# EAGLE design Macropad (EAGLE 9.6.2)
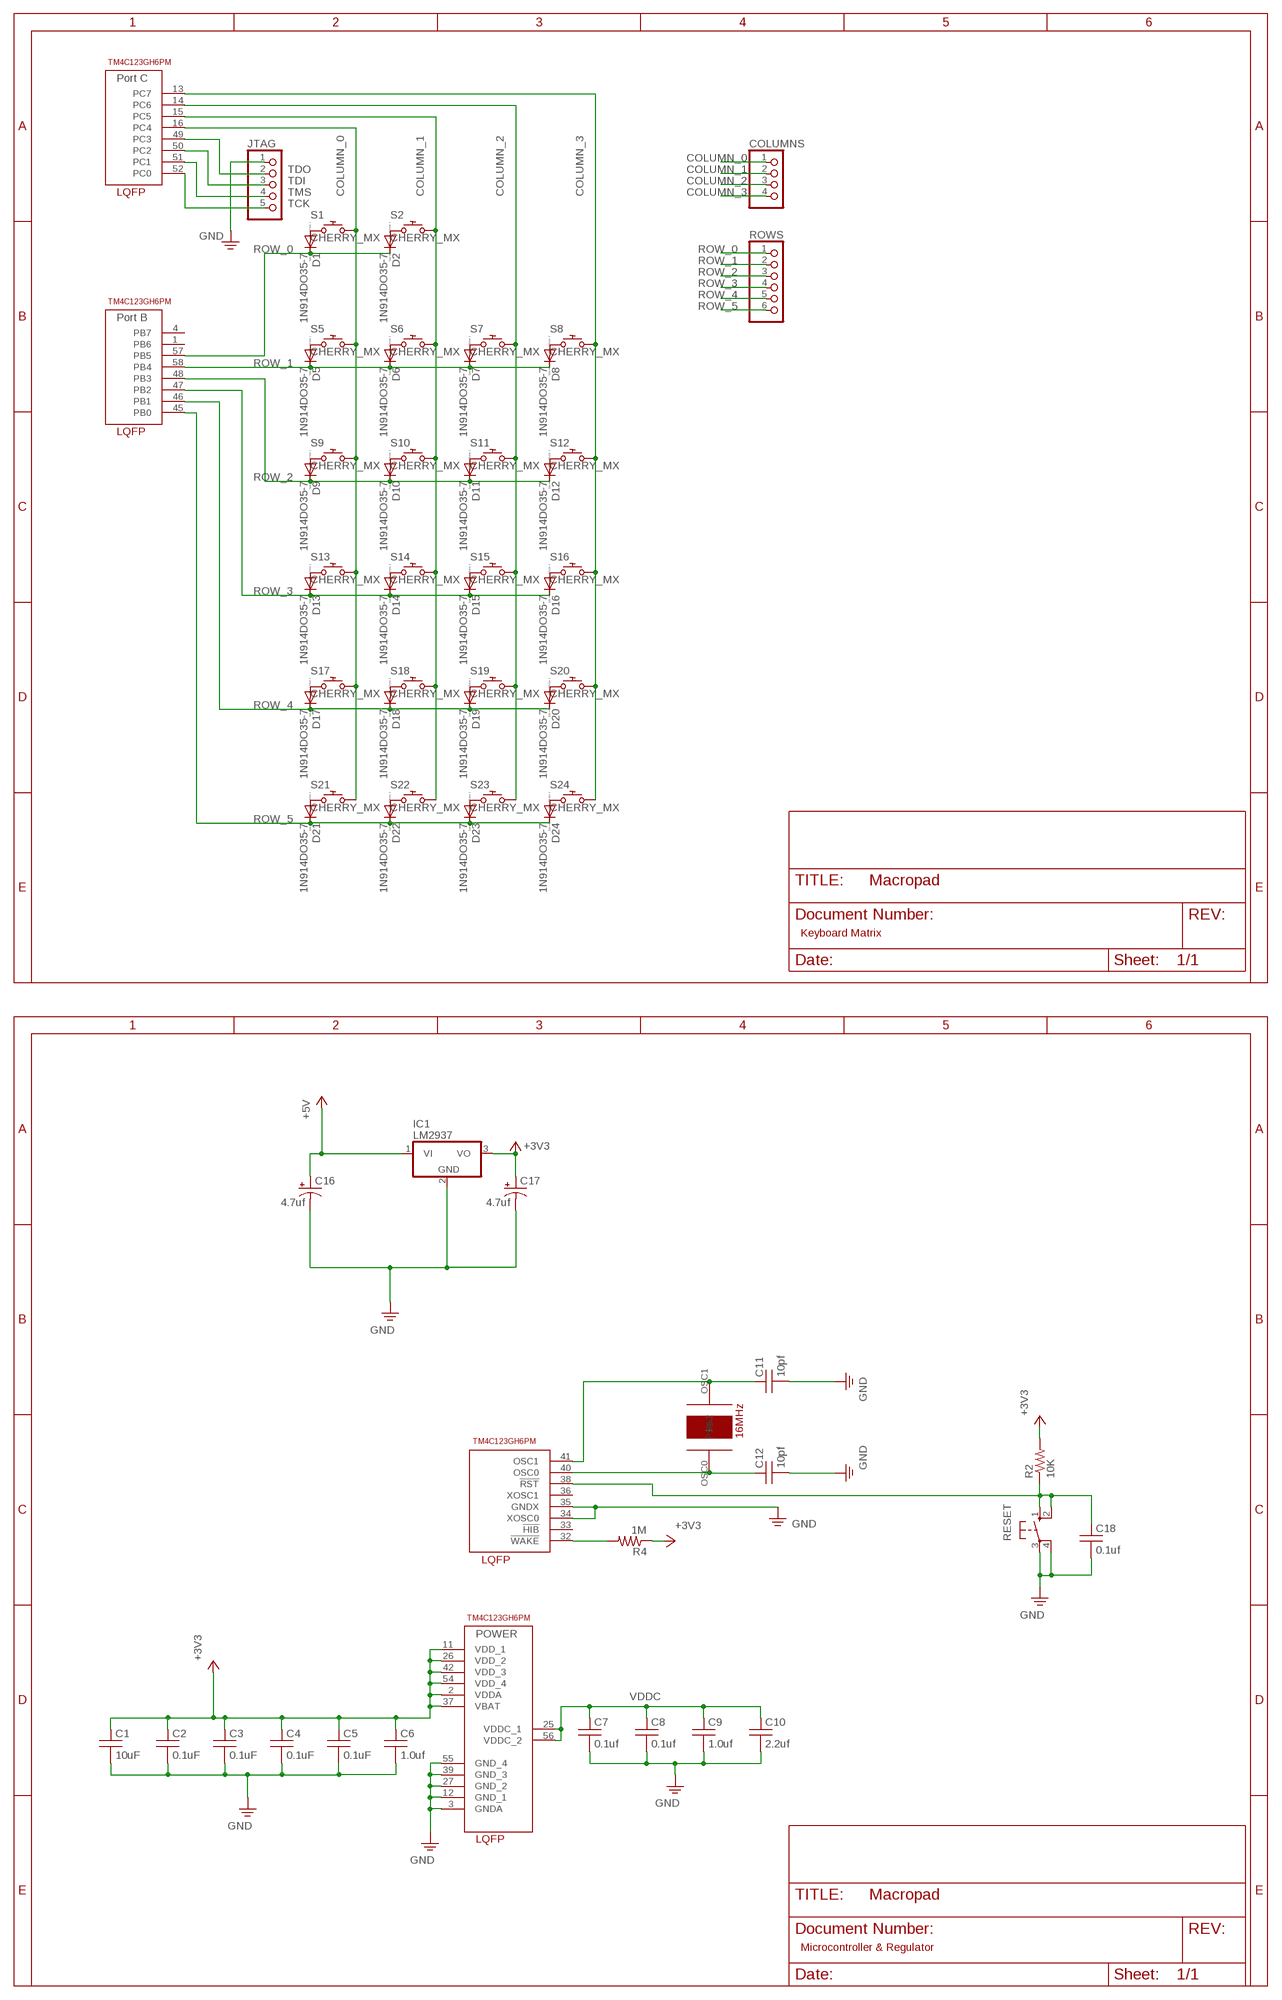
[diagram p0: schematic, sheet 1, part 1 of 2]
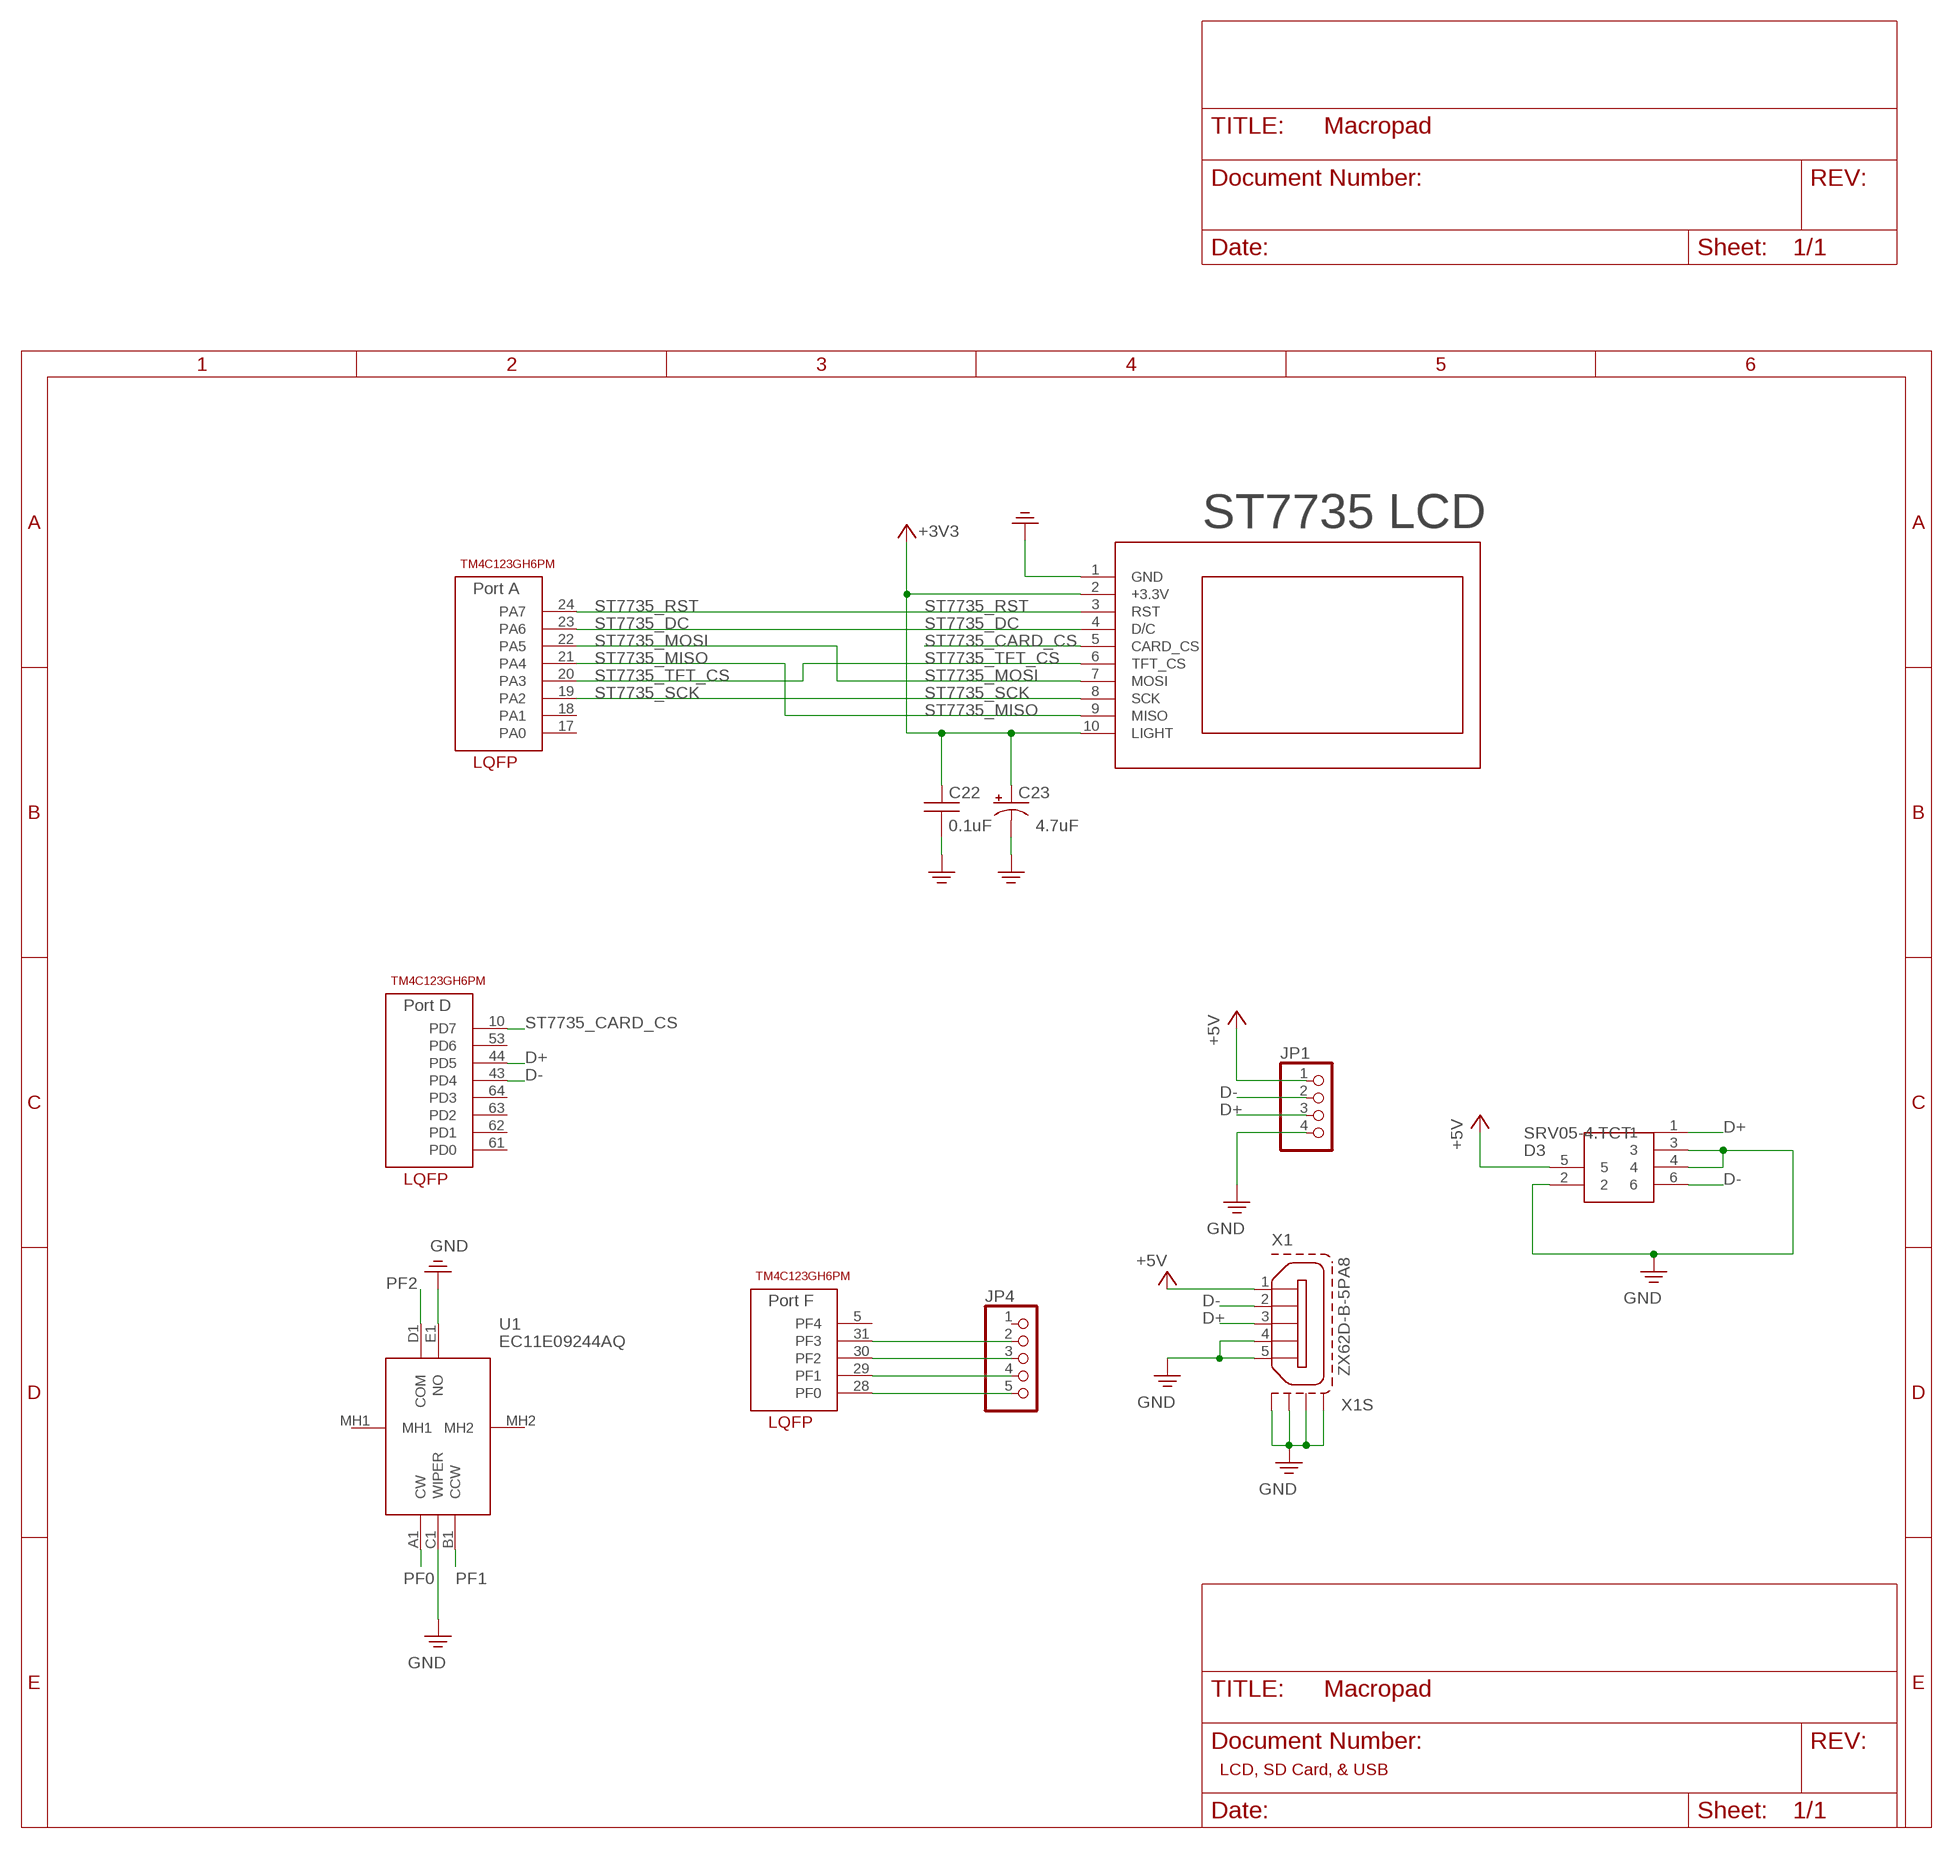
[diagram p1: schematic, sheet 1, part 2 of 2]

## Parts
C1  10uF  CAPACITOR025-024X044  [CAP100MIL]
C2  0.1uF  CAPACITOR025-024X044  [CAP100MIL]
C3  0.1uF  CAPACITOR025-024X044  [CAP100MIL]
C4  0.1uF  CAPACITOR025-024X044  [CAP100MIL]
C5  0.1uF  CAPACITOR025-024X044  [CAP100MIL]
C6  1.0uf  CAPACITOR025-024X044  [CAP100MIL]
C7  0.1uf  CAPACITOR025-024X044  [CAP100MIL]
C8  0.1uf  CAPACITOR025-024X044  [CAP100MIL]
C9  1.0uf  CAPACITOR025-024X044  [CAP100MIL]
C10  2.2uf  CAPACITOR025-024X044  [CAP100MIL]
C11  10pf  CAPACITOR025-024X044  [CAP100MIL]
C12  10pf  CAPACITOR025-024X044  [CAP100MIL]
C16  4.7uf  CAPACITOR_POLARIZEDE5-6  [CAP200MILPOLARIZED]
C17  4.7uf  CAPACITOR_POLARIZEDE5-6  [CAP200MILPOLARIZED]
C18  0.1uf  CAPACITOR025-024X044  [CAP100MIL]
C22  0.1uF  CAPACITOR050-024X044  [CAP200MIL]
C23  4.7uF  CAPACITOR_POLARIZEDE5-6  [CAP200MILPOLARIZED]
COLUMNS  PINHD-1X4  [1X04]
D1  1N914DO35-7  [DO35-7]
D2  1N914DO35-7  [DO35-7]
D3  SRV05-4.TCT  [SOT95P280X145-6N]
D5  1N914DO35-7  [DO35-7]
D6  1N914DO35-7  [DO35-7]
D7  1N914DO35-7  [DO35-7]
D8  1N914DO35-7  [DO35-7]
D9  1N914DO35-7  [DO35-7]
D10  1N914DO35-7  [DO35-7]
D11  1N914DO35-7  [DO35-7]
D12  1N914DO35-7  [DO35-7]
D13  1N914DO35-7  [DO35-7]
D14  1N914DO35-7  [DO35-7]
D15  1N914DO35-7  [DO35-7]
D16  1N914DO35-7  [DO35-7]
D17  1N914DO35-7  [DO35-7]
D18  1N914DO35-7  [DO35-7]
D19  1N914DO35-7  [DO35-7]
D20  1N914DO35-7  [DO35-7]
D21  1N914DO35-7  [DO35-7]
D22  1N914DO35-7  [DO35-7]
D23  1N914DO35-7  [DO35-7]
D24  1N914DO35-7  [DO35-7]
IC1  LM2937  [TO220]
JP1  PINHD-1X4  [1X04]
JP4  PINHD-1X5  [1X05]
JTAG  PINHD-1X5  [1X05]
R2  10K  RESISTOR0204/5  [RES200MIL]
R4  1M  RESISTOR0204/5  [RES200MIL]
RESET  B3F-1052  [B3F-10XX]
ROWS  PINHD-1X6  [1X06]
S1  CHERRY_MX  [CHERRY_MX]
S2  CHERRY_MX  [CHERRY_MX]
S5  CHERRY_MX  [CHERRY_MX]
S6  CHERRY_MX  [CHERRY_MX]
S7  CHERRY_MX  [CHERRY_MX]
S8  CHERRY_MX  [CHERRY_MX]
S9  CHERRY_MX  [CHERRY_MX]
S10  CHERRY_MX  [CHERRY_MX]
S11  CHERRY_MX  [CHERRY_MX]
S12  CHERRY_MX  [CHERRY_MX]
S13  CHERRY_MX  [CHERRY_MX]
S14  CHERRY_MX  [CHERRY_MX]
S15  CHERRY_MX  [CHERRY_MX]
S16  CHERRY_MX  [CHERRY_MX]
S17  CHERRY_MX  [CHERRY_MX]
S18  CHERRY_MX  [CHERRY_MX]
S19  CHERRY_MX  [CHERRY_MX]
S20  CHERRY_MX  [CHERRY_MX]
S21  CHERRY_MX  [CHERRY_MX]
S22  CHERRY_MX  [CHERRY_MX]
S23  CHERRY_MX  [CHERRY_MX]
S24  CHERRY_MX  [CHERRY_MX]
U1  EC11E09244AQ  [EC11E09244AQ]
U$1  TM4C123GH6PM  [QFP50P1200X1200X160-64N]
U$2  16MHZ_CRYSTAL  [16MHZ_CRYSTAL]
U$6  ST7735  [ST7735]
X1  ZX62D-B-5PA8  [ZX62D-B-5PA8]

## Nets
+3V3: C1.1 C2.1 C3.1 C4.1 C5.1 C6.1 C17.+ C22.1 C23.+ IC1.3(VO) R2.2 R4.1 U$1.2(VDDA) U$1.11(VDD_1) U$1.26(VDD_2) U$1.37(VBAT) U$1.42(VDD_3) U$1.54(VDD_4) U$6.2(+3.3V) U$6.10(LIGHT)
+5V: C16.+ D3.5 IC1.1(VI) JP1.1 X1.1
COLUMN_0: COLUMNS.1 S1.S2 S5.S2 S9.S2 S13.S2 S17.S2 S21.S2 U$1.16(PC4)
COLUMN_1: COLUMNS.2 S2.S2 S6.S2 S10.S2 S14.S2 S18.S2 S22.S2 U$1.15(PC5)
COLUMN_2: COLUMNS.3 S7.S2 S11.S2 S15.S2 S19.S2 S23.S2 U$1.14(PC6)
COLUMN_3: COLUMNS.4 S8.S2 S12.S2 S16.S2 S20.S2 S24.S2 U$1.13(PC7)
D+: D3.1 JP1.3 U$1.44(PD5) X1.3
D-: D3.6 JP1.2 U$1.43(PD4) X1.2
GND: C1.2 C2.2 C3.2 C4.2 C5.2 C6.2 C7.2 C8.2 C9.2 C10.2 C11.2 C12.2 C16.- C17.- C18.2 C22.2 C23.- D3.2 D3.3 D3.4 IC1.2(GND) JP1.4 JTAG.1 RESET.3(P) RESET.4(P1) U1.C1(WIPER) U1.E1(NO) U$1.3(GNDA) U$1.12(GND_1) U$1.27(GND_2) U$1.34(XOSC0) U$1.35(GNDX) U$1.39(GND_3) U$1.55(GND_4) U$6.1(GND) X1.4 X1.5 X1.S1 X1.S2 X1.S3 X1.S4
N$3: D1.A S1.S1
N$4: D2.A S2.S1
N$11: D5.A S5.S1
N$12: D6.A S6.S1
N$13: D7.A S7.S1
N$14: D8.A S8.S1
N$15: D9.A S9.S1
N$16: D10.A S10.S1
N$17: D11.A S11.S1
N$18: D12.A S12.S1
N$19: D13.A S13.S1
N$20: D14.A S14.S1
N$21: D15.A S15.S1
N$22: D16.A S16.S1
N$23: D17.A S17.S1
N$24: D18.A S18.S1
N$25: D19.A S19.S1
N$26: D20.A S20.S1
N$27: D21.A S21.S1
N$28: D22.A S22.S1
N$29: D23.A S23.S1
N$30: D24.A S24.S1
OSC0: C12.1 U$1.40(OSC0) U$2.OSC0
OSC1: C11.1 U$1.41(OSC1) U$2.OSC1
PF0: JP4.5 U1.A1(CW) U$1.28(PF0)
PF1: JP4.4 U1.B1(CCW) U$1.29(PF1)
PF2: JP4.3 U1.D1(COM) U$1.30(PF2)
PF3: JP4.2 U$1.31(PF3)
RESET: C18.1 R2.1 RESET.1(S) RESET.2(S1) U$1.38(!RST)
ROW_0: D1.C D2.C ROWS.1 U$1.57(PB5)
ROW_1: D5.C D6.C D7.C D8.C ROWS.2 U$1.58(PB4)
ROW_2: D9.C D10.C D11.C D12.C ROWS.3 U$1.48(PB3)
ROW_3: D13.C D14.C D15.C D16.C ROWS.4 U$1.47(PB2)
ROW_4: D17.C D18.C D19.C D20.C ROWS.5 U$1.46(PB1)
ROW_5: D21.C D22.C D23.C D24.C ROWS.6 U$1.45(PB0)
ST7735_CARD_CS: U$1.10(PD7) U$6.5(CARD_CS)
ST7735_DC: U$1.23(PA6) U$6.4(D/C)
ST7735_MISO: U$1.21(PA4) U$6.9(MISO)
ST7735_MOSI: U$1.22(PA5) U$6.7(MOSI)
ST7735_RST: U$1.24(PA7) U$6.3(RST)
ST7735_SCK: U$1.19(PA2) U$6.8(SCK)
ST7735_TFT_CS: U$1.20(PA3) U$6.6(TFT_CS)
TCK: JTAG.5 U$1.52(PC0)
TDI: JTAG.3 U$1.50(PC2)
TDO: JTAG.2 U$1.49(PC3)
TMS: JTAG.4 U$1.51(PC1)
VDDC: C7.1 C8.1 C9.1 C10.1 U$1.25(VDDC_1) U$1.56(VDDC_2)
WAKE: R4.2 U$1.32(!WAKE)
Unconnected: JP4.1 U1.MH1 U1.MH2 U$1.1(PB6) U$1.4(PB7) U$1.5(PF4) U$1.6(PE3) U$1.7(PE2) U$1.8(PE1) U$1.9(PE0) U$1.17(PA0) U$1.18(PA1) U$1.33(!HIB) U$1.36(XOSC1) U$1.53(PD6) U$1.59(PE4) U$1.60(PE5) U$1.61(PD0) U$1.62(PD1) U$1.63(PD2) U$1.64(PD3)

## Notes on the sheet
- Keyboard Matrix
- ST7735 LCD
- Microcontroller & Regulator | LCD, SD Card, & USB

## Library data of the parts
C1-C12 C18 C22 = EE445L:CAPACITOR: CAPACITOR, American symbol
C16 C17 C23 = EE445L:CAPACITOR_POLARIZED: POLARIZED CAPACITOR, American symbol
COLUMNS JP1 = EE445L:PINHD-1X4: PIN HEADER
D1 D2 D5-D24 = EE445L:1N914: DIODE high speed (Philips) 1N914
D3 = SRV05-4.TCT:SRV05-4.TCT: Semtech SRV05-4.TCT, Uni-Directional TVS Diode Array, 300W, 6-Pin SOT-23 Source: Datasheet <https://componentsearchengine.com/Datasheets/1/SRV05-4.TCT.pdf> Check prices <https://pricing.snapeda.com/parts/SRV05-4.TCT/Semtech/view-part?ref=eda>; AVAILABILITY: In Stock; DESCRIPTION: 17.5V Clamp 12A (8/20µs) Ipp Tvs Diode Surface Mount SOT-23-6; MF: Semtech; MP: SRV05-4.TCT; PACKAGE: SOT-23 Semtech; PRICE: None; PURCHASE-URL: https://pricing.snapeda.com/search/part/SRV05-4.TCT/?ref=eda
IC1 = EE445L:LM2937: LM2937-2.5, LM2937-3.3 400mA and 500mA Voltage Regulators Source: http://cache.national.com/ds/LM/LM2937-2.5.pdf
JP4 JTAG = EE445L:PINHD-1X5: PIN HEADER
R2 R4 = EE445L:RESISTOR: RESISTOR, American symbol
RESET = EE445L:B3F-1052: OMRON SWITCH 1.1mm holes; MPN: B3F-1000; OC_FARNELL: 176432; OC_NEWARK: 36M3542
ROWS = EE445L:PINHD-1X6: PIN HEADER
S1 S2 S5-S24 = cherry:CHERRY_MX: Cherry keymodule MX; FARNELL: 2292961; MOUSER: 540-MX1A-11NW
U1 = SamacSys_Parts:EC11E09244AQ: Encoders 11mm 9 res 18 detent w/ switch lo profile Source: Datasheet <https://componentsearchengine.com/Datasheets/2/EC11E09244AQ.pdf>; DESCRIPTION: Encoders 11mm 9 res 18 detent w/ switch lo profile; HEIGHT: 24.5mm; MANUFACTURER_NAME: Alps Alpine; MANUFACTURER_PART_NUMBER: EC11E09244AQ; MOUSER_PART_NUMBER: 688-EC11E09244AQ; MOUSER_PRICE-STOCK: https://www.mouser.co.uk/ProductDetail/Alps-Alpine/EC11E09244AQ?qs=fMKjfF2mFohVUA4%2Ftyw7NQ%3D%3D
U$1 = EE445L:TM4C123GH6PM
U$2 = EE445L:16MHZ_CRYSTAL
U$6 = EE445L:ST7735
X1 = zx62d-b-5pa8-oshpark_10:ZX62D-B-5PA8: Micro USB Type B Connector - Standard, Shell Through Hole Source: http://www.hirose.co.jp/cataloge_hp/ed_ZX_20140804.pdf; MF: Hirose; MPN: ZX62D-B-5PA8; OC_FARNELL: 2300438; OC_NEWARK: 69W0712

## Board
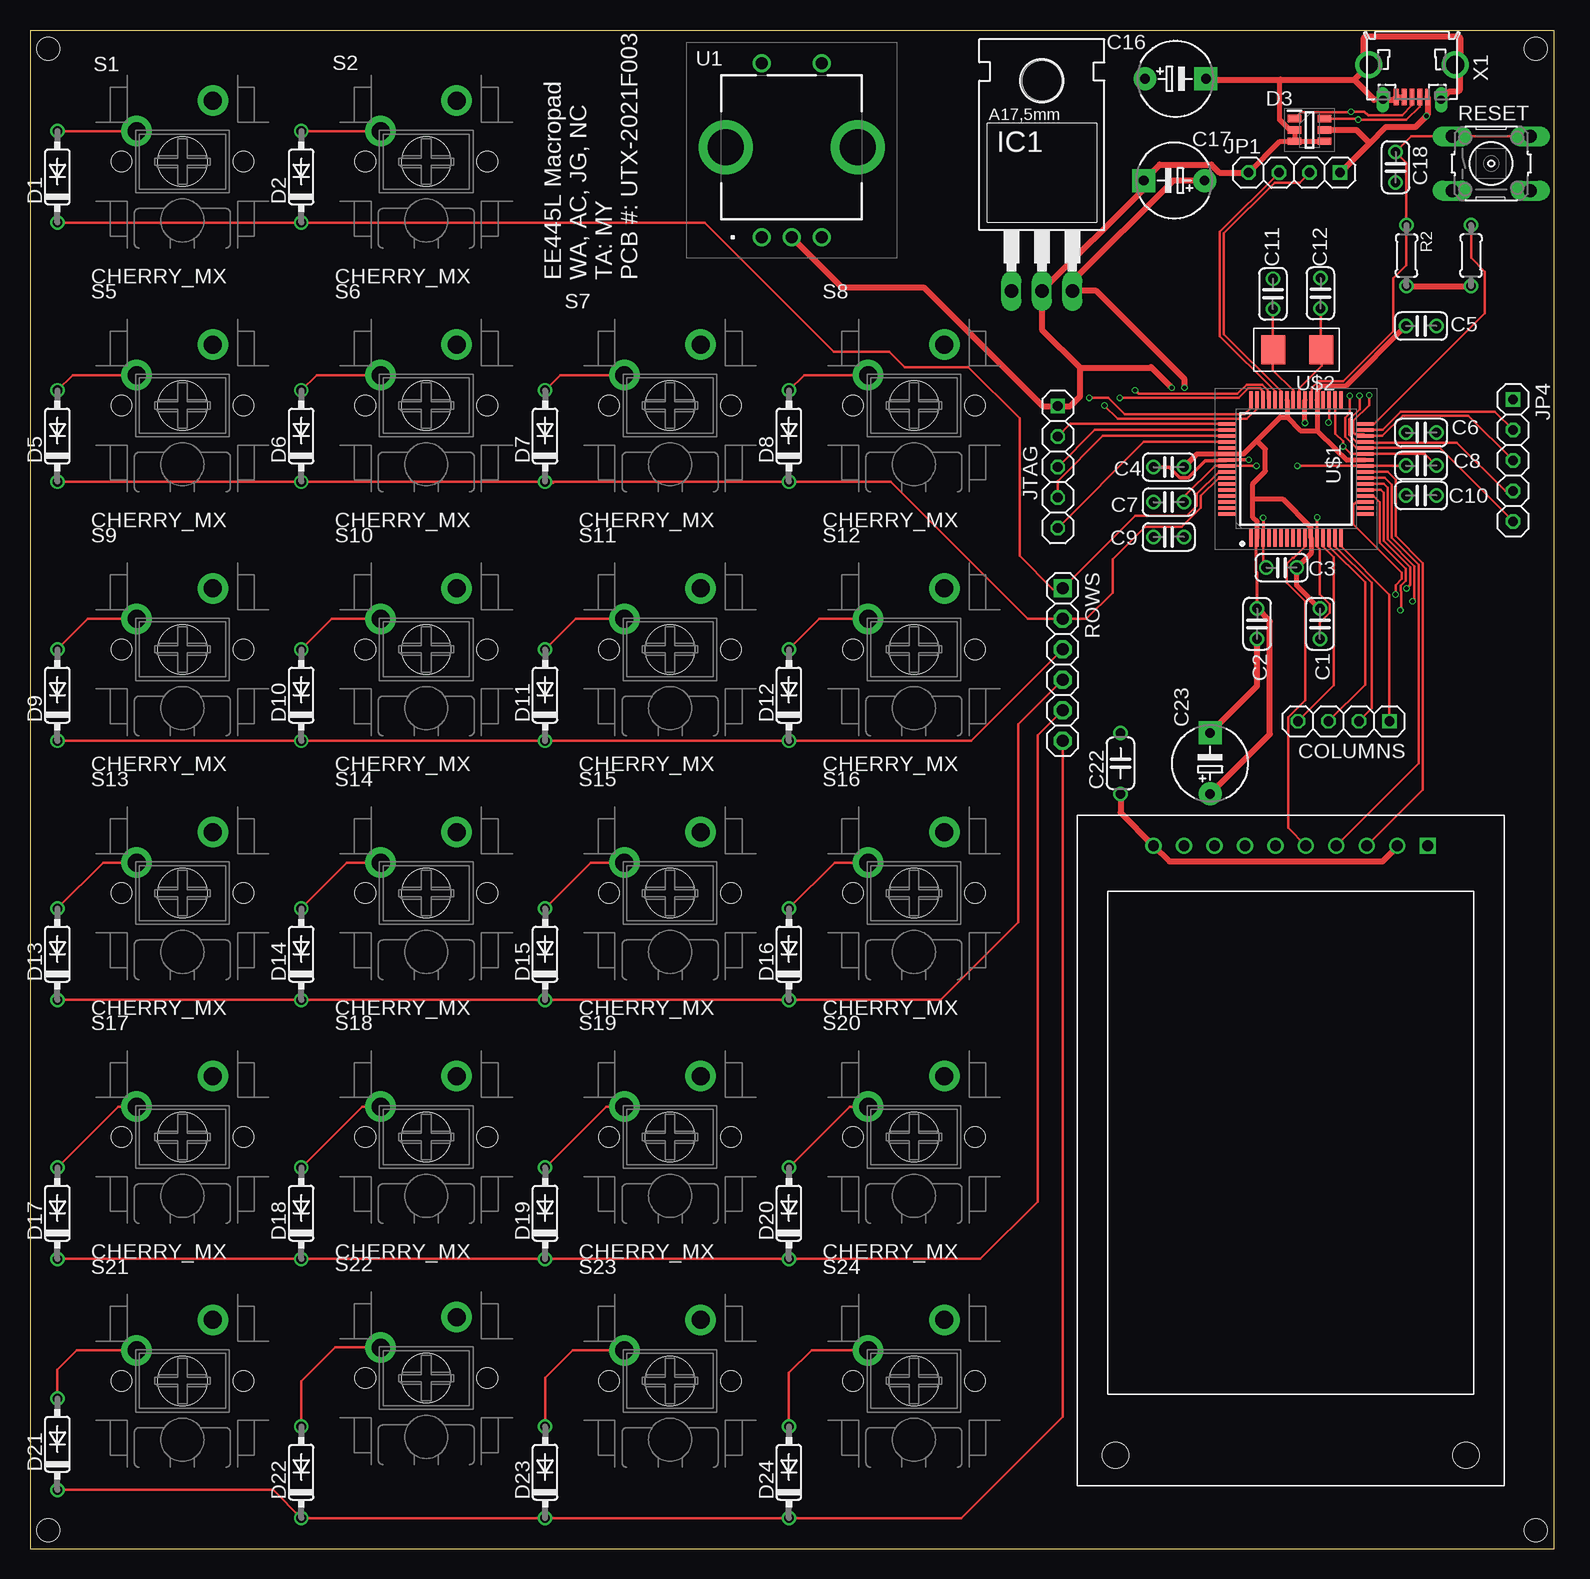
[diagram p2: board, top side]
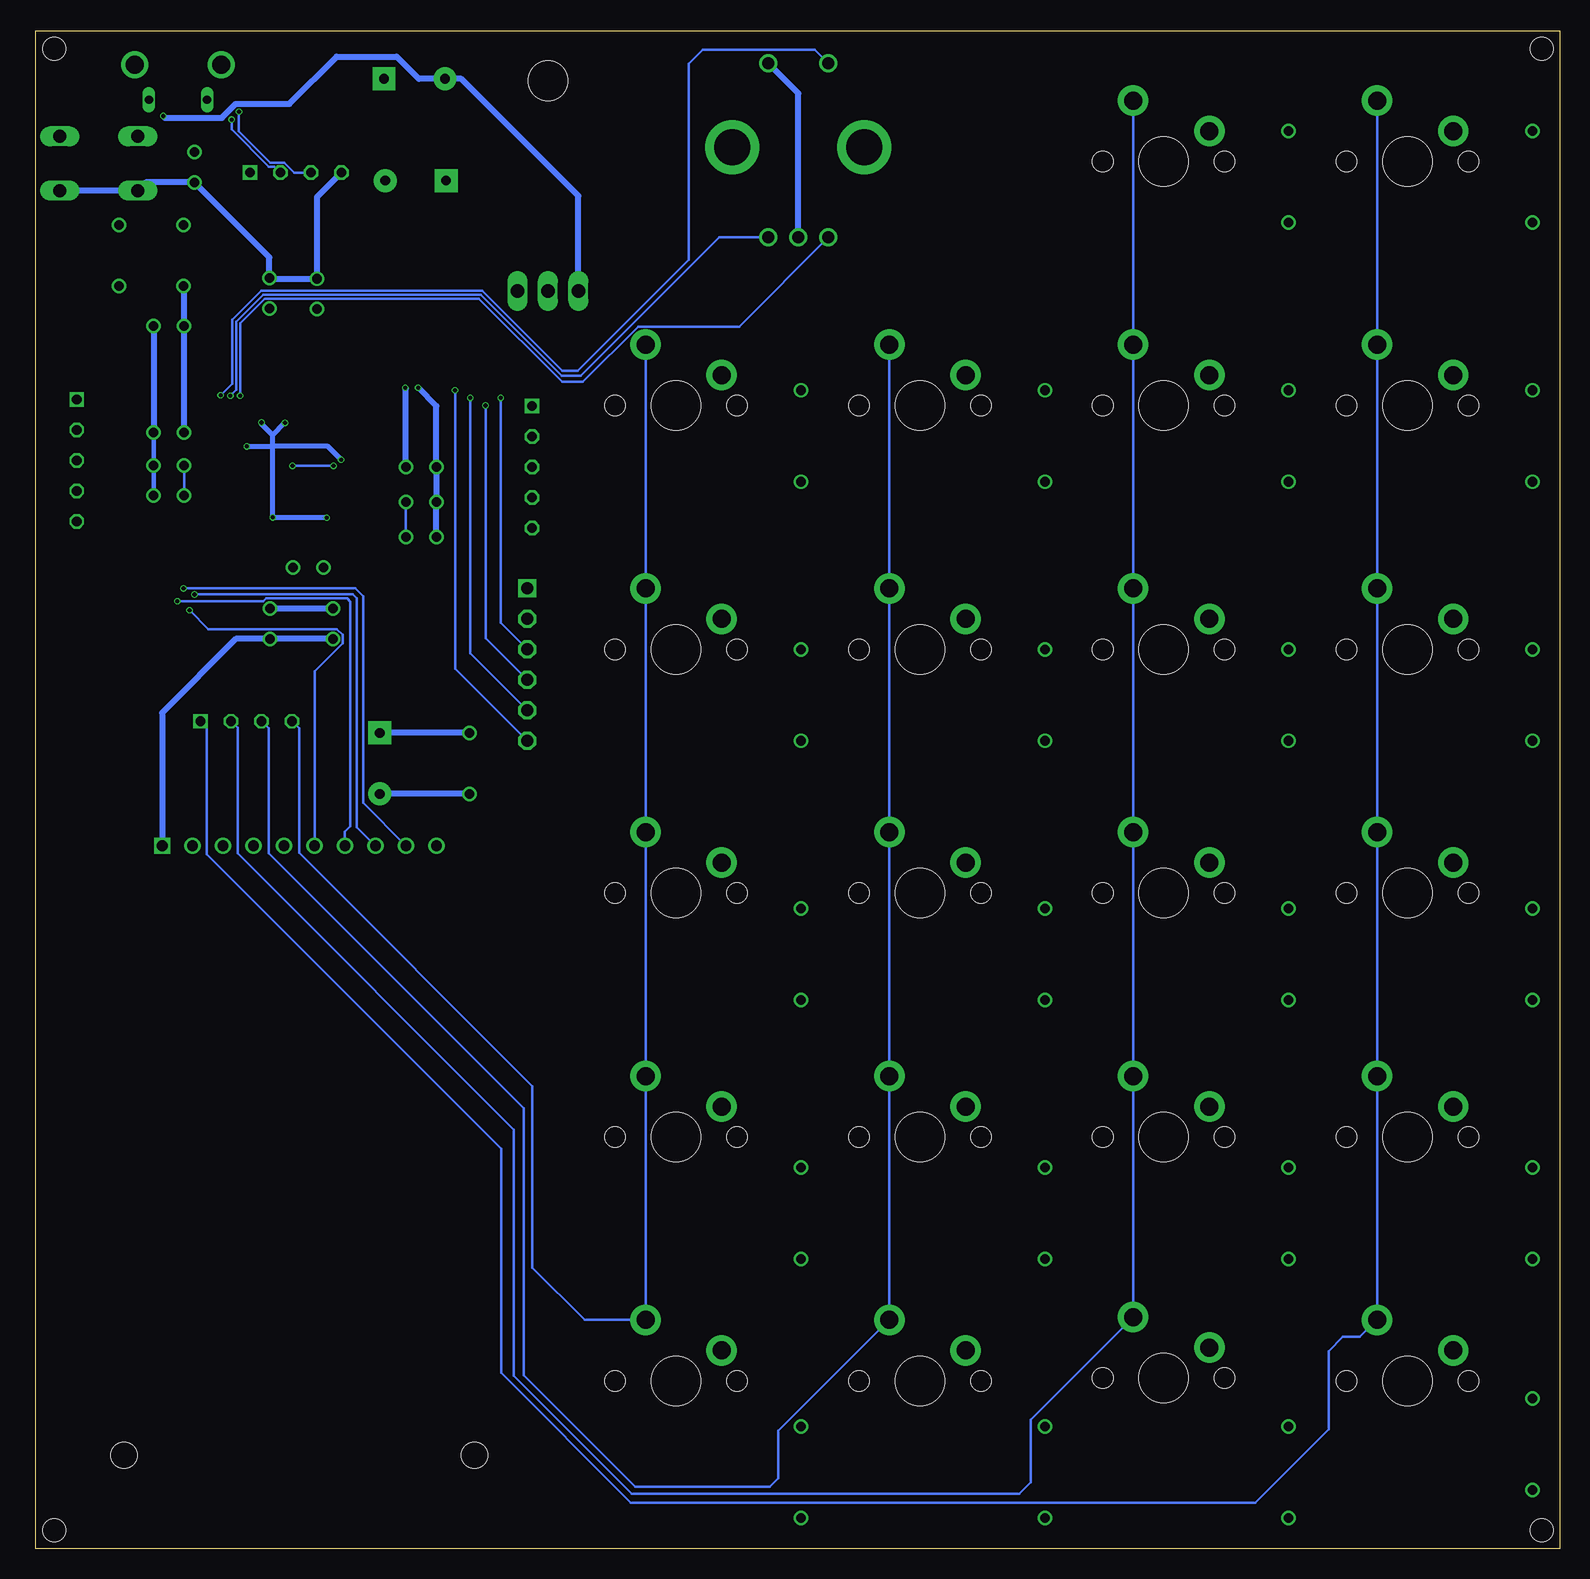
[diagram p3: board, bottom side, seen from below]

Size 127 x 126.49 mm. Coordinates in mm from the lower left corner, seen from the top.
Outline: 0,0 127,0 127,126.49 0,126.49 0,0
Copper layers (1*16): Top 0.035559375mm / dielectric 1.6mm / Bottom 0.035559375mm
Design rules "jlcpcb2layer": minimum track width 5mil, minimum drill 12mil, track to track 5mil, track to pad 5mil, pad to pad 5mil, via to via 5mil, smd to smd 5mil, copper to edge 8mil, drill to drill 6mil, minimum pad ring 5mil, minimum via ring 3mil, stop-mask expansion 2.5mil, vias tented up to drill 0mil, thermal gap 10mil
Holes 1.91 mm at 125.48,124.97 125.48,1.52 1.52,1.52 1.52,124.97

### Footprints (pad centres in the part's own frame; a part is rotated, then mirrored left to right if it is on the bottom)
CAP100MIL = drill 0.8: 1 -1.27,0; 2 1.27,0
CAP200MILPOLARIZED = drill 0.8 pad 1.905: + -2.54,0 | drill 0.8 pad 1.905 square: - 2.54,0
CAP200MIL = drill 0.8: 1 -2.54,0; 2 2.54,0
1X04 = drill 0.8 square: 1 -3.81,0 | drill 0.8 octagon: 2 -1.27,0; 3 1.27,0; 4 3.81,0
DO35-7 = drill 0.8: A 3.81,0; C -3.81,0
SOT95P280X145-6N = smd 1.15 x 0.6: 1 -1.25,0.95; 2 -1.25,0; 3 -1.25,-0.95; 4 1.25,-0.95; 5 1.25,0; 6 1.25,0.95
TO220 = drill 1.1 long: 1 -2.54,-6.35; 2 0,-6.35; 3 2.54,-6.35 | hole 3.302: 0,11.176
1X05 = drill 0.8 square: 1 -5.08,0 | drill 0.8 octagon: 2 -2.54,0; 3 0,0; 4 2.54,0; 5 5.08,0
RES200MIL = drill 0.8: 1 -2.54,0; 2 2.54,0
B3F-10XX = drill 1.1 long: 1 -3.251,2.261; 2 3.251,2.261; 3 -3.251,-2.261; 4 3.251,-2.261
1X06 = drill 1 square: 1 -6.35,0 | drill 1 octagon: 2 -3.81,0; 3 -1.27,0; 4 1.27,0; 5 3.81,0; 6 6.35,0
CHERRY_MX = drill 1.5 pad 2.54: S1 -3.81,2.54; S2 2.54,5.08 | hole 1.7: -5.08,0; 5.08,0 | hole 4.1: 0,0
EC11E09244AQ = drill 1 pad 1.5: A1 0,0; B1 5,0; C1 2.5,0; D1 0,14.5; E1 5,14.5 | drill 3 pad 4.5: MH1 -3,7.5; MH2 8,7.5
QFP50P1200X1200X160-64N = smd 1.475 x 0.3: 1 -5.738,3.75; 2 -5.738,3.25; 3 -5.738,2.75; 4 -5.738,2.25; 5 -5.738,1.75; 6 -5.738,1.25; 7 -5.738,0.75; 8 -5.738,0.25; 9 -5.738,-0.25; 10 -5.738,-0.75; 11 -5.738,-1.25; 12 -5.738,-1.75; 13 -5.738,-2.25; 14 -5.738,-2.75; 15 -5.738,-3.25; 16 -5.738,-3.75; 33 5.738,-3.75; 34 5.738,-3.25; 35 5.738,-2.75; 36 5.738,-2.25; 37 5.738,-1.75; 38 5.738,-1.25; 39 5.738,-0.75; 40 5.738,-0.25; 41 5.738,0.25; 42 5.738,0.75; 43 5.738,1.25; 44 5.738,1.75; 45 5.738,2.25; 46 5.738,2.75; 47 5.738,3.25; 48 5.738,3.75 | smd 0.3 x 1.475: 17 -3.75,-5.738; 18 -3.25,-5.738; 19 -2.75,-5.738; 20 -2.25,-5.738; 21 -1.75,-5.738; 22 -1.25,-5.738; 23 -0.75,-5.738; 24 -0.25,-5.738; 25 0.25,-5.738; 26 0.75,-5.738; 27 1.25,-5.738; 28 1.75,-5.738; 29 2.25,-5.738; 30 2.75,-5.738; 31 3.25,-5.738; 32 3.75,-5.738; 49 3.75,5.738; 50 3.25,5.738; 51 2.75,5.738; 52 2.25,5.738; 53 1.75,5.738; 54 1.25,5.738; 55 0.75,5.738; 56 0.25,5.738; 57 -0.25,5.738; 58 -0.75,5.738; 59 -1.25,5.738; 60 -1.75,5.738; 61 -2.25,5.738; 62 -2.75,5.738; 63 -3.25,5.738; 64 -3.75,5.738
16MHZ_CRYSTAL = smd 2 x 2.4: OSC0 1,1.27; OSC1 5,1.27
ST7735 = drill 0.9 square: 1 0,0 | drill 0.9: 2 0,-2.54; 3 0,-5.08; 4 0,-7.62; 5 0,-10.16; 6 0,-12.7; 7 0,-15.24; 8 0,-17.78; 9 0,-20.32; 10 0,-22.86 | hole 2.184: 50.8,3.175; 50.8,-26.035
ZX62D-B-5PA8 = smd 1.35 x 0.4: 1 4.825,1.3; 2 4.825,0.65; 3 4.825,0; 4 4.825,-0.65; 5 4.825,-1.3 | drill 1.5: S1 2.15,-3.6; S2 2.15,3.6 | drill 0.7 long: S3 5.05,2.425; S4 5.05,-2.425

### Placement (x,y rotation side)
C1  107.49,77.06 270 top
C2  102.26,77.06 270 top
C3  104.29,81.74 180 top
C4  94.89,90.12 180 top
C5  115.93,101.88 0 top
C6  115.93,92.99 0 top
C7  94.89,87.2 180 top
C8  115.93,90.25 0 top
C9  94.89,84.3 180 top
C10  115.93,87.76 0 top
C11  103.58,104.55 90 top
C12  107.54,104.6 90 top
C16  95.45,122.48 0 top
C17  95.35,114 180 top
C18  113.79,115.11 270 top
C22  90.88,65.43 90 top
C23  98.35,65.43 90 top
COLUMNS  109.47,68.94 180 top
D1  2.29,114.3 90 top
D2  22.61,114.3 90 top
D3  106.63,118.21 0 top
D5  2.29,92.71 90 top
D6  22.61,92.71 90 top
D7  42.93,92.71 90 top
D8  63.25,92.71 90 top
D9  2.29,71.12 90 top
D10  22.61,71.12 90 top
D11  42.93,71.12 90 top
D12  63.25,71.12 90 top
D13  2.29,49.53 90 top
D14  22.61,49.53 90 top
D15  42.93,49.53 90 top
D16  63.25,49.53 90 top
D17  2.29,27.94 90 top
D18  22.61,27.94 90 top
D19  42.93,27.94 90 top
D20  63.25,27.94 90 top
D21  2.29,8.69 90 top
D22  22.61,6.35 90 top
D23  42.93,6.35 90 top
D24  63.25,6.35 90 top
IC1  84.33,111.15 0 top
JP1  105.36,114.66 180 top
JP4  123.6,90.68 270 top
JTAG  85.65,90.12 270 top
R2  114.71,107.75 270 top
R4  120.09,107.75 90 top
RESET  121.77,115.42 0 top
ROWS  86.06,73.66 270 top
S1  12.7,115.57 0 top
S2  33.02,115.57 0 top
S5  12.7,95.25 0 top
S6  33.02,95.25 0 top
S7  53.34,95.25 0 top
S8  73.66,95.25 0 top
S9  12.7,74.93 0 top
S10  33.02,74.93 0 top
S11  53.34,74.93 0 top
S12  73.66,74.93 0 top
S13  12.7,54.61 0 top
S14  33.02,54.61 0 top
S15  53.34,54.61 0 top
S16  73.66,54.61 0 top
S17  12.7,34.29 0 top
S18  33.02,34.29 0 top
S19  53.34,34.29 0 top
S20  73.66,34.29 0 top
S21  12.7,13.97 0 top
S22  33.02,14.2 0 top
S23  53.34,13.97 0 top
S24  73.66,13.97 0 top
U1  60.96,109.27 0 top
U$1  105.51,89.97 90 top
U$2  108.58,101.17 180 top
U$6  116.48,58.57 270 top
X1  115.16,125.78 270 top

### Tracks (layer width: path | path; a pad name or v marks a point on that pad's centre or on a via)
+3V3  (via drill 0.35)
  Top 0.254: C2.1 102.26,81.29 102.17,81.38 102.17,84.14 U$1.2
  Top 0.406: C4.1 97.26,91.22 U$1.54 101.13,91.22 102.24,92.33 | 107.29,93.17 107.26,93.19 U$1.37 107.28,95.72 107.28,96.58 107.56,96.86 109.64,96.86 C5.1 | 107.29,93.17 105.87,93.17 104.76,94.27 | U$1.2 102.26,85.56 101.92,85.91 101.92,87.43 | 101.92,87.43 101.92,88.73 102.95,89.77 102.95,91.61 102.24,92.33 | C2.1 | 107.29,93.17 108.83,91.63 108.83,91.6 109.72,90.72 U$1.26 | U$1.42 104.76,94.27 | 102.24,92.33 104.18,94.27 104.76,94.27 | 101.92,87.43 104.42,87.43 106.74,85.1 106.74,84.25 U$1.11 106.76,82.94 C3.1 105.56,80.26 C1.1
  Top 0.508: R2.2 R4.1 | C23.+ 103.33,67.87 103.33,77.27 C2.1 | C22.1 90.88,61.32 U$6.10 94.94,57.25 112.72,57.25 113.94,58.47 U$6.2 | v96.22,96.72 96.22,97.43 88.85,104.8 IC1.3 86.87,105.61 95.25,114 C17.+
  Bottom 0.508: C6.1 C5.1 114.66,105.16 R2.2 | C22.1 C23.+ | C2.1 C1.1 | C4.1 96.16,96.67 v96.22,96.72
+5V  (via drill 0.35)
  Top 0.508: X1.1 116.46,119.46 v116.38,119.38 115.47,118.47 112.98,118.47 111.63,117.12 | JP1.1 111.63,117.12 | 111.63,117.12 110.54,118.21 D3.5
  Bottom 0.508: IC1.1 81.79,112.72 91.54,122.48 C16.+ 95.09,122.48 96.93,124.32 101.95,124.32 105.89,120.38 110.35,120.38 111.5,119.23 116.23,119.23 v116.38,119.38
COLUMN_0
  Top 0.203: U$1.16 109.26,83.52 113.28,79.5 COLUMNS.1
  Bottom 0.203: S1.S2 S5.S2 S9.S2 S13.S2 S17.S2 S21.S2 16.66,17.63 18.09,17.63 19.25,16.46 19.25,16.41 19.25,16.36 19.25,9.96 25.4,3.81 77.42,3.81 88.24,14.63 88.24,33.33 112.78,57.86 112.78,68.43 COLUMNS.1
COLUMN_1
  Top 0.203: U$1.15 108.78,84.21 108.78,83.5 111.81,80.47 111.81,70 COLUMNS.2
  Bottom 0.203: S2.S2 S6.S2 S10.S2 S14.S2 S18.S2 S22.S2 44.09,10.74 44.09,5.54 45.06,4.57 77.37,4.57 87.17,14.38 87.17,34.9 110.2,57.92 110.2,68.39 COLUMNS.2
COLUMN_2
  Top 0.203: U$1.14 108.28,84.21 108.28,83.5 111.25,80.53 111.25,71.98 COLUMNS.3
  Bottom 0.203: S7.S2 S11.S2 S15.S2 S19.S2 S23.S2 65.13,9.8 65.13,5.84 65.84,5.13 77.06,5.13 86.36,14.43 86.36,36.68 107.61,57.92 107.61,68.34 COLUMNS.3
COLUMN_3
  Top 0.203: U$1.13 107.76,83.48 108.65,82.59 108.65,71.92 COLUMNS.4
  Bottom 0.203: S8.S2 S12.S2 S16.S2 S20.S2 S24.S2 81.28,19.05 85.62,23.39 85.62,38.54 105.06,57.98 105.06,68.34 COLUMNS.4
D+  (via drill 0.35)
  Top 0.203: U$1.44 103.76,96.44 99.16,101.04 99.16,109.73 JP1.3 | X1.3 115.16,120.25 114.34,119.43 111.51,119.43 111.2,119.74 v110.08,119.74 110.04,119.69 105.91,119.69 D3.1
  Bottom 0.203: v110.08,119.74 110.08,118.11 107.46,115.48 106.29,115.48 105.46,114.66 JP1.3
D-  (via drill 0.35)
  Top 0.203: U$1.43 104.26,96.42 99.49,101.19 99.49,109.59 103.73,113.83 105.8,113.83 JP1.2 | X1.2 115.8,120.94 115.8,120.17 114.7,119.08 v110.69,119.08 110.61,119.16 D3.6
  Bottom 0.203: JP1.2 107.13,115.15 107.59,115.15 110.69,118.25 v110.69,119.08
GND  (via drill 0.35)
  Top 0.203: v107.26,85.93 | U$1.12 107.28,84.21 107.28,83.5 107.49,83.29 107.49,79.5 108.32,78.68 108.32,77.99 107.49,77.16 C1.2 | C8.2 116.22,91.22 U$1.27 110.05,91.22 v109.42,91.85 109.42,92.26 108.78,92.91 108.78,95.69 U$1.34 | v108.2,93.83 108.25,93.88 U$1.35 | C3.2 102.76,82 U$1.3
  Top 0.254: U$1.12 v107.26,85.93 | v102.76,85.9 U$1.3
  Top 0.305: v101.57,90.74 101.55,90.72 U$1.55 99.7,90.65 97.94,90.65 96.53,89.24 95.8,89.24 94.92,90.12 C4.2
  Top 0.406: D3.3 D3.2 105.36,118.23 104.97,118.23 104.14,119.06 104.14,122.35 104.19,122.4 | D3.3 D3.4 | JP1.4 104.16,117.26 D3.3 | v106.25,93.8 106.25,95.69 U$1.39
  Top 0.508: C16.- 98.07,122.4 104.19,122.4 110.34,122.4 | C23.- 102.26,71.88 C2.2 | U1.C1 67.63,105.11 74.47,105.11 84.38,95.2 JTAG.1 86.67,95.2 87.5,96.03 87.5,98.4 | 87.5,98.4 84.33,101.58 IC1.2 92.81,113.28 C17.- 94.14,115.33 98.44,115.33 99.12,114.66 JP1.4 | v95.15,96.72 93.42,98.45 93.37,98.4 87.5,98.4 | 110.34,122.4 112.02,120.72 112.72,120.72 X1.S4 112.77,120.7 113.61,120.7 X1.5 X1.4 | 110.34,122.4 X1.S1 111.56,123.87 111.16,124.28 111.16,125.89 111.31,126.03 119.02,126.03 119.17,125.89 119.17,124.28 118.76,123.87 X1.S2 118.76,123.39 119.17,122.99 119.17,121.58 119.02,121.43 118.28,121.43 X1.S3
  Bottom 0.381: C10.2 117.2,90.59 117.12,90.67 C8.2 C6.2
  Bottom 0.406: 107.26,91.85 v107.26,85.93 107.24,85.9 v102.76,85.9 | 107.26,91.85 107.26,92.79 | 107.26,92.79 v106.25,93.8 | v109.42,91.85 107.26,91.85 | v101.57,90.74 102.68,91.85 107.26,91.85 | v108.2,93.83 108.2,93.73 107.26,92.79
  Bottom 0.508: C9.2 C7.2 C4.2 93.62,95.2 v95.15,96.72 | U1.C1 63.46,121.27 U1.E1 | C2.2 C1.2 110.34,75.79 116.48,69.65 U$6.1 | RESET.4 RESET.3 117.83,113.84 C18.2 107.54,107.59 C12.2 107.49,105.82 C11.2 103.58,112.62 JP1.4 | C5.2 C6.2 | C22.2 C23.-
N$3
  Top 0.203: D1.A S1.S1
N$4
  Top 0.203: D2.A S2.S1
N$11
  Top 0.203: D5.A 3.56,97.79 S5.S1
N$12
  Top 0.203: D6.A 23.88,97.79 S6.S1
N$13
  Top 0.203: D7.A 44.2,97.79 S7.S1
N$14
  Top 0.203: D8.A 64.52,97.79 S8.S1
N$15
  Top 0.203: D9.A 4.83,77.47 S9.S1
N$16
  Top 0.203: D10.A 25.15,77.47 S10.S1
N$17
  Top 0.203: D11.A 45.47,77.47 S11.S1
N$18
  Top 0.203: D12.A 65.79,77.47 S12.S1
N$19
  Top 0.203: D13.A 6.1,57.15 S13.S1
N$20
  Top 0.203: D14.A 26.42,57.15 S14.S1
N$21
  Top 0.203: D15.A 46.74,57.15 S15.S1
N$22
  Top 0.203: D16.A 67.06,57.15 S16.S1
N$23
  Top 0.203: D17.A 7.37,36.83 S17.S1
N$24
  Top 0.203: D18.A 27.69,36.83 S18.S1
N$25
  Top 0.203: D19.A 48.01,36.83 S19.S1
N$26
  Top 0.203: D20.A 68.33,36.83 S20.S1
N$27
  Top 0.203: D21.A 2.29,14.88 3.91,16.51 S21.S1
N$28
  Top 0.203: D22.A 22.61,13.92 25.45,16.76 29.18,16.76 S22.S1
N$29
  Top 0.203: D23.A 42.93,14.22 45.21,16.51 S23.S1
N$30
  Top 0.203: D24.A 63.25,14.63 65.13,16.51 S24.S1
OSC0
  Top 0.203: U$1.40 105.76,96.67 107.64,98.55 107.64,99.84 U$2.OSC0 107.54,99.94 C12.1
OSC1
  Top 0.203: U$1.41 105.26,96.52 103.58,98.2 U$2.OSC1 C11.1
PF0  (via drill 0.35)
  Top 0.203: v109.98,96.06 109.98,94.59 109.62,94.23 109.62,92.63 110.52,91.74 111.23,91.74 U$1.28 117.48,91.72 JP4.5
  Bottom 0.203: U1.A1 68.4,101.83 76.82,101.83 81.42,97.23 83.16,97.23 90.08,104.16 107.93,104.16 109.98,102.11 v109.98,96.06
PF1  (via drill 0.35)
  Top 0.203: v110.8,96.06 110.8,94.94 109.95,94.1 109.95,92.8 110.52,92.24 111.23,92.24 U$1.29 111.31,92.16 118.91,92.16 122.94,88.14 JP4.4
  Bottom 0.203: U1.B1 70.05,109.27 81.58,97.74 83.2,97.74 89.95,104.49 108.07,104.49 110.31,102.25 110.31,96.55 v110.8,96.06
PF2  (via drill 0.35)
  Top 0.203: v111.61,96.11 111.61,95.29 110.28,93.96 110.28,92.97 110.42,92.84 111.13,92.84 U$1.30 112.69,92.72 114.38,94.41 119.87,94.41 JP4.3
  Bottom 0.203: U1.D1 62.11,124.92 71.42,124.92 72.59,123.75 72.59,107.39 81.84,98.15 83.14,98.15 89.81,104.82 108.21,104.82 110.64,102.38 110.64,97.08 v111.61,96.11
PF3
  Top 0.203: U$1.31 112.72,93.22 114.25,94.74 122.07,94.74 JP4.2
RESET
  Top 0.203: RESET.2 RESET.1 115.09,117.68 C18.1 114.71,115.47 R2.1 114.71,106.94 113.62,105.86 113.62,101.46 109.46,97.29 107.38,97.29 106.83,96.74 106.83,95.77 U$1.38
ROW_0
  Top 0.203: D1.C D2.C 56.24,110.49 66.98,99.75 71.6,99.75 72.9,98.45 78.18,98.45 82.46,94.17 82.46,82.71 85.21,79.96 86,79.96 ROWS.1 92.1,86.06 96.4,86.06 97.25,86.91 97.25,87.9 99.04,89.7 99.75,89.7 U$1.57
ROW_1
  Top 0.203: D5.C D6.C D7.C | D7.C 43.48,88.9 43.59,88.8 43.03,88.8 D7.C | D7.C D8.C 71.73,88.9 83.16,77.47 ROWS.2 88.04,77.47 90.22,79.65 90.22,82.43 92.93,85.13 95.99,85.13 97.58,86.72 97.58,87.73 99.04,89.2 99.75,89.2 U$1.58
ROW_2  (via drill 0.35)
  Top 0.203: D9.C D10.C D11.C D12.C 78.44,67.31 ROWS.3 | v88.27,95.89 89.86,95.89 91.23,94.51 101.19,94.51 101.76,95.08 U$1.48
  Bottom 0.203: ROWS.3 88.27,77.14 v88.27,95.89
ROW_3  (via drill 0.35)
  Top 0.203: D13.C D14.C D15.C D16.C 75.89,45.72 82.35,52.17 82.35,68.68 ROWS.4 | U$1.47 102.29,95.67 102.29,95.03 101.4,94.13 90.65,94.13 v89.53,95.25
  Bottom 0.203: v89.53,95.25 89.53,75.87 ROWS.4
ROW_4  (via drill 0.35)
  Top 0.203: D17.C D18.C D19.C D20.C 79.21,24.13 83.99,28.91 83.99,67.78 ROWS.5 | U$1.46 102.74,95.72 102.74,96.44 102.51,96.67 101.52,96.67 100.73,95.89 v90.81,95.89
  Bottom 0.203: v90.81,95.89 90.81,74.6 ROWS.5
ROW_5  (via drill 0.35)
  Top 0.203: D21.C 20.27,4.88 D22.C D23.C D24.C 77.62,2.54 86.06,10.97 ROWS.6 | U$1.45 103.14,95.83 103.14,96.54 102.68,97 101.38,97 100.59,96.22 92.38,96.22 v92.08,96.52
  Bottom 0.203: v92.08,96.52 92.08,73.33 ROWS.6
ST7735_CARD_CS
  Top 0.203: U$6.5 104.83,60.06 104.83,69.28 106.26,70.7 106.26,78.95 104.73,80.48 104.73,82.08 105.22,82.57 105.31,82.57 106.26,83.52 U$1.10
ST7735_DC
  Top 0.203: U$1.23 112.89,89.22 113.46,88.65 113.46,84.24 115.72,81.98 115.72,65.43 U$6.4
ST7735_MISO  (via drill 0.35)
  Top 0.203: U$1.21 112.57,88.22 112.8,87.99 112.8,83.97 115.01,81.76 115.01,80.31 v114.71,80.01
  Bottom 0.203: U$6.9 99.72,62.13 99.72,79.35 100.38,80.01 v114.71,80.01
ST7735_MOSI  (via drill 0.35)
  Top 0.203: U$1.22 112.81,88.72 113.13,88.39 113.13,84.11 115.37,81.87 115.37,79.1 v115.21,78.94
  Bottom 0.203: U$6.7 101.24,59.74 100.79,60.2 100.79,78.92 101.04,79.17 107.83,79.17 108.06,78.94 v115.21,78.94
ST7735_RST
  Top 0.203: U$1.24 113.13,89.72 113.79,89.05 113.79,84.38 116.05,82.12 116.05,63.22 U$6.3
ST7735_SCK  (via drill 0.35)
  Top 0.203: U$1.19 111.23,87.2 110.52,87.2 110.28,86.96 110.28,85.35 114.33,81.31 114.33,80.8 113.79,80.27 v113.79,79.5
  Bottom 0.203: v113.79,79.5 100.58,79.5 100.25,79.17 100.25,60.12 U$6.8
ST7735_TFT_CS  (via drill 0.35)
  Top 0.203: U$1.20 111.27,87.7 111.98,87.7 112.47,87.21 112.47,83.83 114.66,81.65 114.66,80.65 114.22,80.21 114.22,79.81 114.28,79.74 114.28,78.27 v114.2,78.18
  Bottom 0.203: v114.2,78.18 112.64,76.62 101.92,76.62 101.43,76.14 101.43,75.45 103.78,73.1 U$6.6
TCK
  Top 0.203: JTAG.5 92.83,92.22 U$1.52
TDI
  Top 0.203: JTAG.3 88.75,93.22 U$1.50
TDO
  Top 0.203: U$1.49 86.71,93.72 JTAG.2
TMS
  Top 0.203: U$1.51 89.41,92.71 85.65,88.95 JTAG.4
VDDC  (via drill 0.35)
  Top 0.203: C8.1 114.64,90.22 U$1.25 109.27,90.22 v105.61,90.22 | C7.1 96.16,87.63 98.75,90.22 U$1.56 v102.21,90.22
  Bottom 0.203: C7.1 C9.1 | C8.1 C10.1 | v102.21,90.22 v105.61,90.22
WAKE
  Top 0.203: R4.2 120.09,107.55 121.22,106.41 121.22,102.93 112.01,93.72 U$1.32

### Text on the board
tPlace: EE445L Macropad / WA, AC, JG, NC / TA: MY / PCB #: UTX-2021F003